# Altium schematic sheet Zigbee.SchDoc
size A2
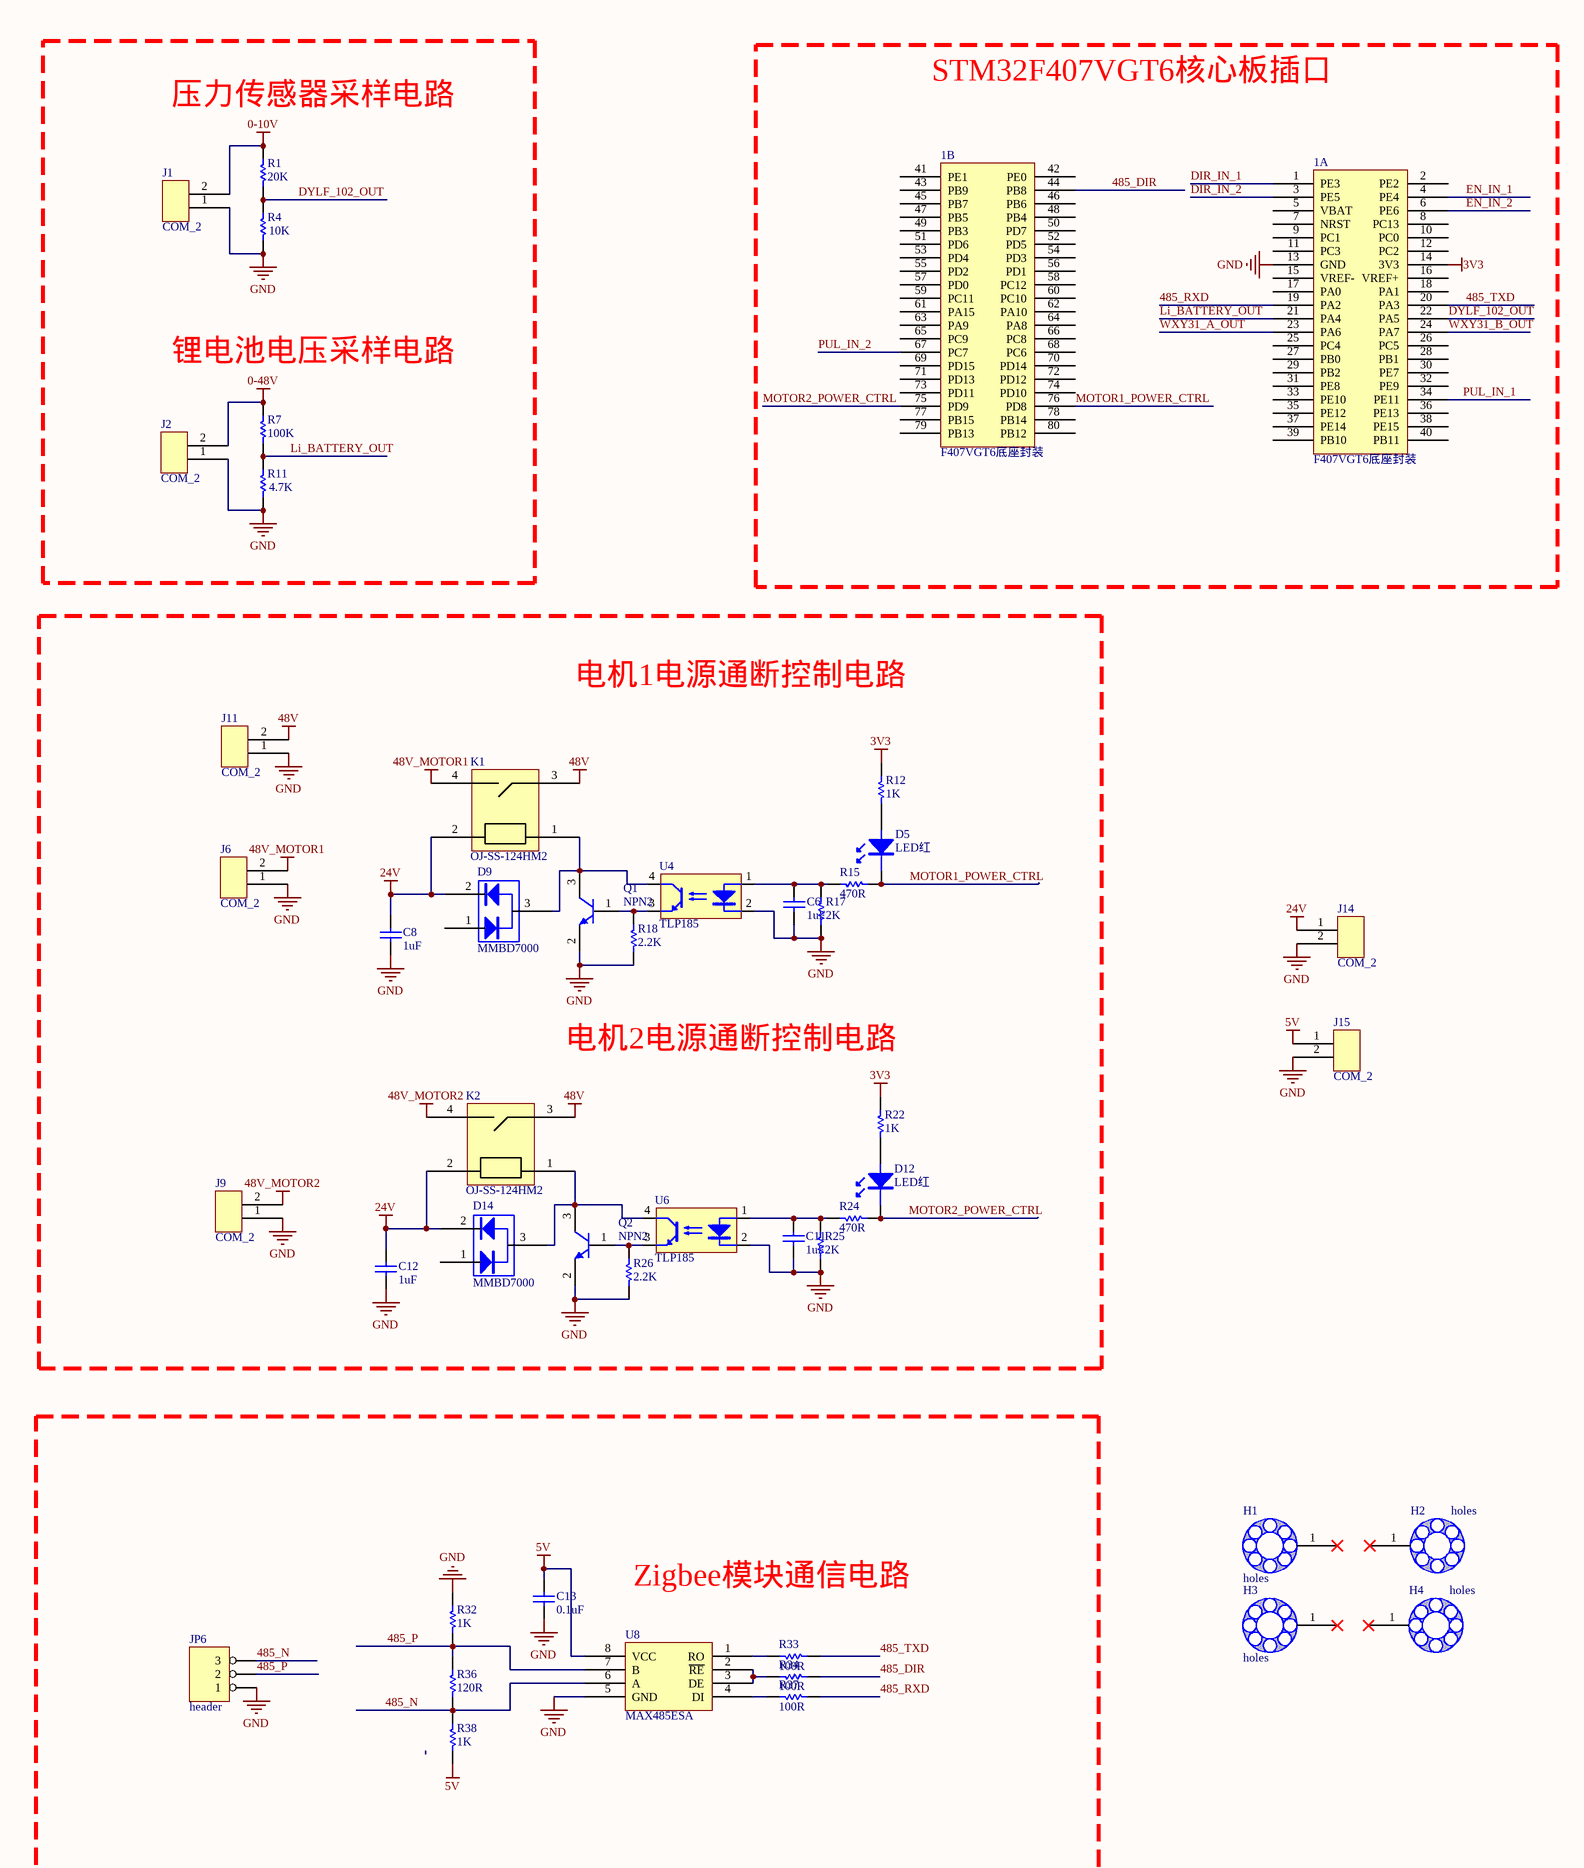
[diagram p0: Zigbee.SchDoc, left]
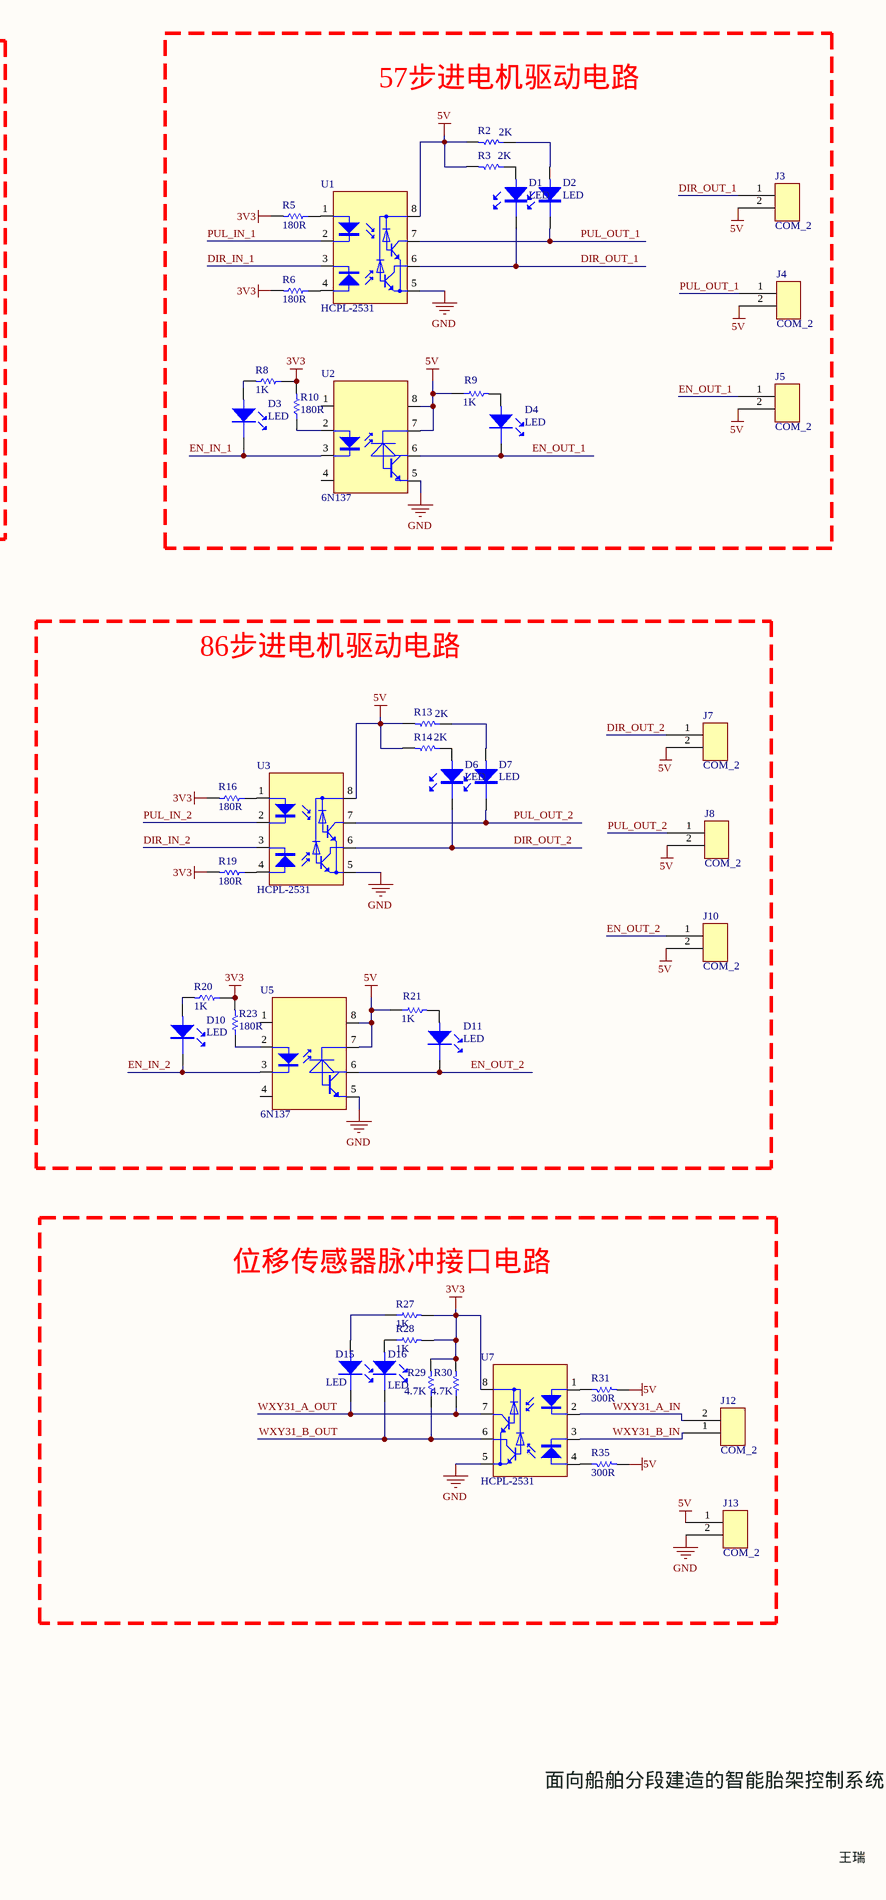
[diagram p1: Zigbee.SchDoc, right]

## Parts
1  F407VGT6底座封装  [F407VGT6底座封装]  (parts A,B of 2)
C6  1uF  [0603_C]
C8  1uF  [0603_C]
C11  1uF  [0603_C]
C12  1uF  [0603_C]
C13  0.1uF  [0603_C]
D1  LED  [0603_LED]
D2  LED  [0603_LED]
D3  LED  [0603_LED]
D4  LED  [0603_LED]
D5  LED红  [0603_LED]
D6  LED  [0603_LED]
D7  LED  [0603_LED]
D9  MMBD7000  [SOT23]
D10  LED  [0603_LED]
D11  LED  [0603_LED]
D12  LED红  [0603_LED]
D14  MMBD7000  [SOT23]
D15  LED  [0603_LED]
D16  LED  [0603_LED]
H1  holes  [铜柱（小焊盘）]
H2  holes  [铜柱（小焊盘）]
H3  holes  [铜柱（小焊盘）]
H4  holes  [铜柱（小焊盘）]
J1  COM_2  [5.08A-2PIN]
J2  COM_2  [5.08A-2PIN]
J3  COM_2  [5.08A-2PIN]
J4  COM_2  [5.08A-2PIN]
J5  COM_2  [5.08A-2PIN]
J6  COM_2  [5.08A-2PIN]
J7  COM_2  [5.08A-2PIN]
J8  COM_2  [5.08A-2PIN]
J9  COM_2  [5.08A-2PIN]
J10  COM_2  [5.08A-2PIN]
J11  COM_2  [5.08A-2PIN]
J12  COM_2  [5.08A-2PIN]
J13  COM_2  [5.08A-2PIN]
J14  COM_2  [5.08A-2PIN]
J15  COM_2  [5.08A-2PIN]
JP6  header  [5.08A-3PIN]
K1  OJ-SS-124HM2  [G4A-1A-PE-24V]
K2  OJ-SS-124HM2  [G4A-1A-PE-24V]
Q1  NPN2  [SOT-23-3]
Q2  NPN2  [SOT-23-3]
R1  20K  [0603_R]
R2  2K  [0603_R]
R3  2K  [0603_R]
R4  10K  [0603_R]
R5  180R  [0603_R]
R6  180R  [0603_R]
R7  100K  [0603_R]
R8  1K  [0603_R]
R9  1K  [0603_R]
R10  180R  [0603_R]
R11  4.7K  [0603_R]
R12  1K  [0603_R]
R13  2K  [0603_R]
R14  2K  [0603_R]
R15  470R  [0603_R]
R16  180R  [0603_R]
R17  2K  [0603_R]
R18  2.2K  [0603_R]
R19  180R  [0603_R]
R20  1K  [0603_R]
R21  1K  [0603_R]
R22  1K  [0603_R]
R23  180R  [0603_R]
R24  470R  [0603_R]
R25  2K  [0603_R]
R26  2.2K  [0603_R]
R27  1K  [0603_R]
R28  1K  [0603_R]
R29  4.7K  [0603_R]
R30  4.7K  [0603_R]
R31  300R  [0603_R]
R32  1K  [0603_R]
R33  100R  [0603_R]
R34  100R  [0603_R]
R35  300R  [0603_R]
R36  120R  [0603_R]
R37  100R  [0603_R]
R38  1K  [0603_R]
U1  HCPL-2531  [SOP8]
U2  6N137  [SOP8]
U3  HCPL-2531  [SOP8]
U4  TLP185  [SOP4]
U5  6N137  [SOP8]
U6  TLP185  [SOP4]
U7  HCPL-2531  [SOP8]
U8  MAX485ESA  [SOP8]

## Nets
0-10V: J1.2 R1.1
0-48V: J2.2 R7.1
3V3: 1.14(3V3) R5.2 R6.2 R8.1 R10.2 R12.2 R16.2 R19.2 R20.1 R22.2 R23.2 R27.2 R28.2 R29.2 R30.2 U7.8
5V: C13.2 J3.2 J4.2 J5.2 J7.2 J8.2 J10.2 J13.1 J15.1 R2.2 R3.2 R9.1 R13.2 R14.2 R21.1 R31.2 R35.2 R38.1 U1.8 U2.7 U2.8 U3.8 U5.7 U5.8 U8.8(VCC)
24V: C8.2 C12.2 D9.2 D14.2 J14.1 K1.2 K2.2
48V: J11.2 K1.3 K2.3
48V_MOTOR1: J6.2 K1.4
48V_MOTOR2: J9.2 K2.4
GND: 1.13(GND) C6.2 C8.1 C11.2 C12.1 C13.1 J1.1 J2.1 J6.1 J9.1 J11.1 J13.2 J14.2 J15.2 JP6.1 Q1.2(E) Q2.2(E) R4.2 R11.2 R17.2 R18.2 R25.2 R26.2 R32.2 U1.5 U2.5 U3.5 U4.2 U5.5 U6.2 U7.5 U8.5(GND)
485_DIR: 1.44(PB8) R34.2
485_N: JP6.3 R36.1 R38.2 U8.6(A)
485_P: JP6.2 R32.1 R36.2 U8.7(B)
485_RXD: 1.19(PA2) R37.2
485_TXD: 1.20(PA3) R33.2
DIR_IN_1: 1.1(PE3) U1.3
DIR_IN_2: 1.3(PE5) U3.3
DIR_OUT_1: D1.2(K) J3.1 U1.6
DIR_OUT_2: D6.2(K) J7.1 U3.6
DYLF_102_OUT: 1.22(PA5) R1.2 R4.1
EN_IN_1: 1.4(PE4) D3.2(K) U2.3
EN_IN_2: 1.6(PE6) D10.2(K) U5.3
EN_OUT_1: D4.2(K) J5.1 U2.6
EN_OUT_2: D11.2(K) J10.1 U5.6
Li_BATTERY_OUT: 1.21(PA4) R7.2 R11.1
MOTOR1_POWER_CTRL: 1.76(PD8) D5.2(K) R15.2
MOTOR2_POWER_CTRL: 1.75(PD9) D12.2(K) R24.2
PUL_IN_1: 1.34(PE11) U1.2
PUL_IN_2: 1.67(PC7) U3.2
PUL_OUT_1: D2.2(K) J4.1 U1.7
PUL_OUT_2: D7.2(K) J8.1 U3.7
WXY31_A_IN: J12.2 U7.2
WXY31_A_OUT: 1.23(PA6) D15.2(K) R30.1 U7.7
WXY31_B_IN: J12.1 U7.3
WXY31_B_OUT: 1.24(PA7) D16.2(K) R29.1 U7.6
NetC6_1: C6.1 R15.1 R17.1 U4.1
NetC11_1: C11.1 R24.1 R25.1 U6.1
NetD1_1: D1.1(A) R3.1
NetD2_1: D2.1(A) R2.1
NetD3_1: D3.1(A) R8.2
NetD4_1: D4.1(A) R9.2
NetD5_1: D5.1(A) R12.1
NetD6_1: D6.1(A) R14.1
NetD7_1: D7.1(A) R13.1
NetD9_3: D9.3 K1.1 Q1.3(C) U4.4
NetD10_1: D10.1(A) R20.2
NetD11_1: D11.1(A) R21.2
NetD12_1: D12.1(A) R22.1
NetD14_3: D14.3 K2.1 Q2.3(C) U6.4
NetD15_1: D15.1(A) R27.1
NetD16_1: D16.1(A) R28.1
NetQ1_1: Q1.1(B) R18.1 U4.3
NetQ2_1: Q2.1(B) R26.1 U6.3
NetR5_1: R5.1 U1.1
NetR6_1: R6.1 U1.4
NetR10_1: R10.1 U2.2
NetR16_1: R16.1 U3.1
NetR19_1: R19.1 U3.4
NetR23_1: R23.1 U5.2
NetR31_1: R31.1 U7.1
NetR33_1: R33.1 U8.1(RO)
NetR34_1: R34.1 U8.2(~{RE}) U8.3(DE)
NetR35_1: R35.1 U7.4
NetR37_1: R37.1 U8.4(DI)

Not connected (* = marked no-connect by the designer): 1 2(PE2) 5(VBAT) 7(NRST) 8(PC13) 9(PC1) 10(PC0) 11(PC3) 12(PC2) 15(VREF-) 16(VREF+) 17(PA0) 18(PA1) 25(PC4) 26(PC5) 27(PB0) 28(PB1) 29(PB2) 30(PE7) 31(PE8) 32(PE9) 33(PE10) 35(PE12) 36(PE13) 37(PE14) 38(PE15) 39(PB10) 40(PB11) 41(PE1) 42(PE0) 43(PB9) 45(PB7) 46(PB6) 47(PB5) 48(PB4) 49(PB3) 50(PD7) 51(PD6) 52(PD5) 53(PD4) 54(PD3) 55(PD2) 56(PD1) 57(PD0) 58(PC12) 59(PC11) 60(PC10) 61(PA15) 62(PA10) 63(PA9) 64(PA8) 65(PC9) 66(PC8) 68(PC6) 69(PD15) 70(PD14) 71(PD13) 72(PD12) 73(PD11) 74(PD10) 77(PB15) 78(PB14) 79(PB13) 80(PB12); D9 1; D14 1; H1 1*; H2 1*; H3 1*; H4 1*; U2 1 4; U5 1 4

## Notes on the sheet
- (near R1) 压力传感器采样电路
- STM32F407VGT6核心板插口
- 57步进电机驱动电路
- (near R7) 锂电池电压采样电路
- 电机1电源通断控制电路
- 86步进电机驱动电路
- 电机2电源通断控制电路
- (near R27) 位移传感器脉冲接口电路
- Zigbee模块通信电路
- 面向船舶分段建造的智能胎架控制系统
- 王瑞

## Library data of the parts
C6 C8 C11-C13 = CAP: Capacitor; Value: 104; Published: 8-Jun-2000; LatestRevisionDate: 17-Jul-2002; LatestRevisionNote: Re-released for DXP Platform.; PackageReference: RAD-0.3; Publisher: Altium Limited
D1-D7 D10-D12 D15 D16 = LED: LED 发光二极管
H1-H4 = 铜柱
JP6 = HEADER 3
Q1 Q2 = NPN2: 贴片
R1-R7 R10 R11 R13-R19 R23-R26 R29-R31 R33-R37 = RES: Resistor; Value: 1K; Published: 8-Jun-2000; Revision: July-2002: Re-released for DXP Platform.; Publisher: Altium Limited
R8 R9 R12 R20-R22 R27 R28 R32 R38 = RES: Resistor; Published: 8-Jun-2000; Revision: July-2002: Re-released for DXP Platform.; Publisher: Altium Limited; Value: 1K
U4 U6 = TLP184